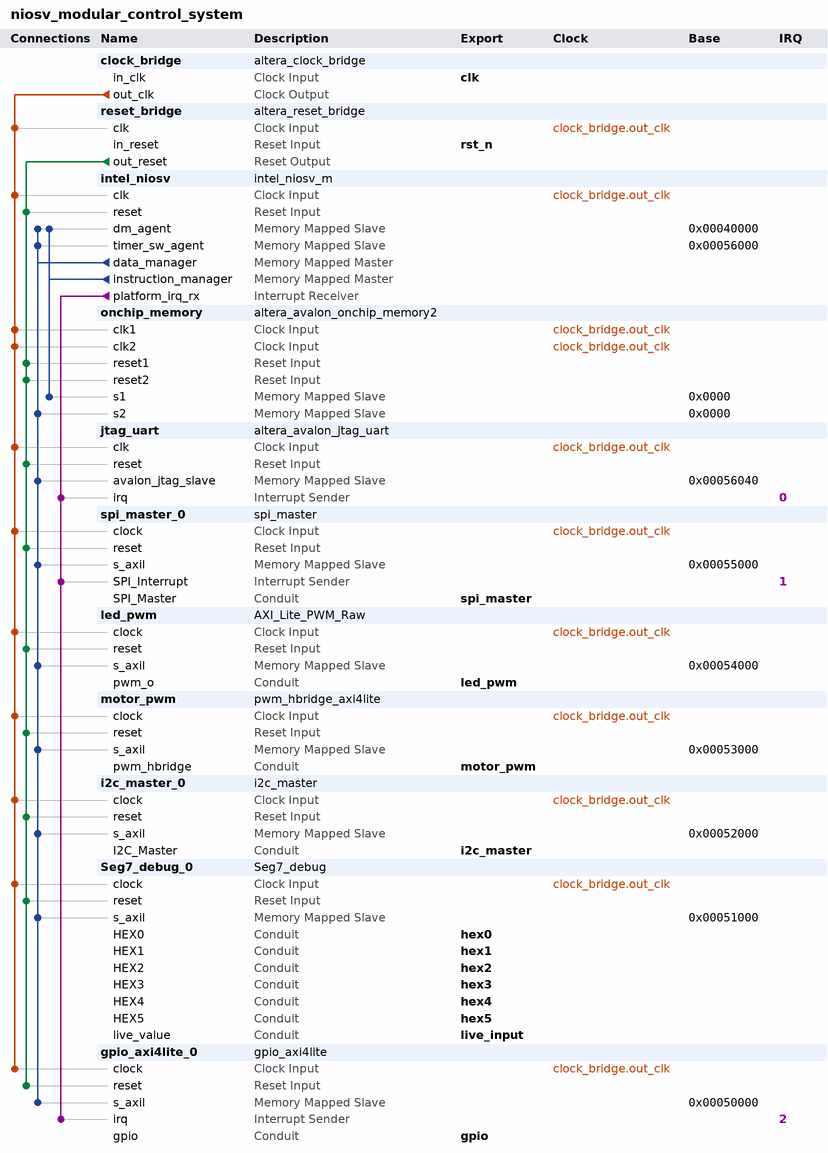
[diagram p0: system contents]
# Platform Designer (Qsys) system niosv_modular_control_system, MAX 10 10M50DAF484C6GES
# Parameters at their usual value, and those the tool derives, are not listed.
package require -exact qsys 25.1
create_system niosv_modular_control_system
set_project_property DEVICE_FAMILY {MAX 10}
set_project_property DEVICE 10M50DAF484C6GES

add_instance clock_bridge altera_clock_bridge 25.1
set_instance_parameter_value clock_bridge DERIVED_CLOCK_RATE 0
set_instance_parameter_value clock_bridge EXPLICIT_CLOCK_RATE 50000000

add_instance reset_bridge altera_reset_bridge 25.1
set_instance_parameter_value reset_bridge ACTIVE_LOW_RESET 1
set_instance_parameter_value reset_bridge SYNCHRONOUS_EDGES deassert

add_instance intel_niosv intel_niosv_m 26.0.0
set_instance_parameter_value intel_niosv enableAvalonInterface false
set_instance_parameter_value intel_niosv enableDebugReset false
set_instance_parameter_value intel_niosv enableECCFull false
set_instance_parameter_value intel_niosv enableECCLite false
set_instance_parameter_value intel_niosv hartId 0
set_instance_parameter_value intel_niosv interruptMode 0
set_instance_parameter_value intel_niosv pipelineArch true
set_instance_parameter_value intel_niosv resetSlave onchip_memory.s1

add_instance onchip_memory altera_avalon_onchip_memory2 25.1
set_instance_parameter_value onchip_memory dataWidth 32
set_instance_parameter_value onchip_memory dualPort true
set_instance_parameter_value onchip_memory initMemContent false
set_instance_parameter_value onchip_memory initializationFileName D:/fpga_projects/fpga-modular-control-system/ram.hex
set_instance_parameter_value onchip_memory memorySize 163840

add_instance jtag_uart altera_avalon_jtag_uart 25.1
set_instance_parameter_value jtag_uart simInteractiveOptions NO_INTERACTIVE_WINDOWS

add_instance spi_master_0 spi_master 1.0
set_instance_parameter_value spi_master_0 ADDR_W 12
set_instance_parameter_value spi_master_0 CLKDIV 20
set_instance_parameter_value spi_master_0 CPHA 1
set_instance_parameter_value spi_master_0 CPOL 1
set_instance_parameter_value spi_master_0 DATA_W 32
set_instance_parameter_value spi_master_0 SPI_DW 8

add_instance led_pwm AXI_Lite_PWM_Raw 3.0
set_instance_parameter_value led_pwm APPLY_ON_PERIOD_END true
set_instance_parameter_value led_pwm AXI_ADDR_W 12
set_instance_parameter_value led_pwm AXI_DATA_W 32
set_instance_parameter_value led_pwm CHANNELS 10
set_instance_parameter_value led_pwm CNT_W 32

add_instance motor_pwm pwm_hbridge_axi4lite 3
set_instance_parameter_value motor_pwm APPLY_ON_PERIOD_END true
set_instance_parameter_value motor_pwm AXI_ADDR_W 12
set_instance_parameter_value motor_pwm AXI_DATA_W 32
set_instance_parameter_value motor_pwm CHANNELS 2
set_instance_parameter_value motor_pwm CNT_W 32

add_instance i2c_master_0 i2c_master 1.0
set_instance_parameter_value i2c_master_0 ADDR_W 12
set_instance_parameter_value i2c_master_0 BYTE_W 8
set_instance_parameter_value i2c_master_0 CMD_W 3
set_instance_parameter_value i2c_master_0 DATA_W 32
set_instance_parameter_value i2c_master_0 DIVISOR_W 16
set_instance_parameter_value i2c_master_0 MIN_DIVISOR 1

add_instance Seg7_debug_0 Seg7_debug 1.0
set_instance_parameter_value Seg7_debug_0 ADDR_W 12
set_instance_parameter_value Seg7_debug_0 DATA_W 32
set_instance_parameter_value Seg7_debug_0 NUM_DIGITS 6

add_instance gpio_axi4lite_0 gpio_axi4lite 1.0
set_instance_parameter_value gpio_axi4lite_0 ADDR_W 12
set_instance_parameter_value gpio_axi4lite_0 DATA_W 32
set_instance_parameter_value gpio_axi4lite_0 GPIO_W 32

# connections
add_connection clock_bridge.out_clk gpio_axi4lite_0.clock clock
add_connection clock_bridge.out_clk i2c_master_0.clock clock
add_connection clock_bridge.out_clk intel_niosv.clk clock
add_connection clock_bridge.out_clk jtag_uart.clk clock
add_connection clock_bridge.out_clk led_pwm.clock clock
add_connection clock_bridge.out_clk motor_pwm.clock clock
add_connection clock_bridge.out_clk onchip_memory.clk1 clock
add_connection clock_bridge.out_clk onchip_memory.clk2 clock
add_connection clock_bridge.out_clk reset_bridge.clk clock
add_connection clock_bridge.out_clk Seg7_debug_0.clock clock
add_connection clock_bridge.out_clk spi_master_0.clock clock
add_connection reset_bridge.out_reset gpio_axi4lite_0.reset reset
add_connection reset_bridge.out_reset i2c_master_0.reset reset
add_connection reset_bridge.out_reset intel_niosv.reset reset
add_connection reset_bridge.out_reset jtag_uart.reset reset
add_connection reset_bridge.out_reset led_pwm.reset reset
add_connection reset_bridge.out_reset motor_pwm.reset reset
add_connection reset_bridge.out_reset onchip_memory.reset1 reset
add_connection reset_bridge.out_reset onchip_memory.reset2 reset
add_connection reset_bridge.out_reset Seg7_debug_0.reset reset
add_connection reset_bridge.out_reset spi_master_0.reset reset
add_connection intel_niosv.data_manager gpio_axi4lite_0.s_axil avalon
set_connection_parameter_value intel_niosv.data_manager/gpio_axi4lite_0.s_axil baseAddress 0x00050000
add_connection intel_niosv.data_manager i2c_master_0.s_axil avalon
set_connection_parameter_value intel_niosv.data_manager/i2c_master_0.s_axil baseAddress 0x00052000
add_connection intel_niosv.data_manager intel_niosv.dm_agent avalon
set_connection_parameter_value intel_niosv.data_manager/intel_niosv.dm_agent baseAddress 0x00040000
add_connection intel_niosv.data_manager intel_niosv.timer_sw_agent avalon
set_connection_parameter_value intel_niosv.data_manager/intel_niosv.timer_sw_agent baseAddress 0x00056000
add_connection intel_niosv.data_manager jtag_uart.avalon_jtag_slave avalon
set_connection_parameter_value intel_niosv.data_manager/jtag_uart.avalon_jtag_slave baseAddress 0x00056040
add_connection intel_niosv.data_manager led_pwm.s_axil avalon
set_connection_parameter_value intel_niosv.data_manager/led_pwm.s_axil baseAddress 0x00054000
add_connection intel_niosv.data_manager motor_pwm.s_axil avalon
set_connection_parameter_value intel_niosv.data_manager/motor_pwm.s_axil baseAddress 0x00053000
add_connection intel_niosv.data_manager onchip_memory.s2 avalon
set_connection_parameter_value intel_niosv.data_manager/onchip_memory.s2 baseAddress 0x0000
add_connection intel_niosv.data_manager Seg7_debug_0.s_axil avalon
set_connection_parameter_value intel_niosv.data_manager/Seg7_debug_0.s_axil baseAddress 0x00051000
add_connection intel_niosv.data_manager spi_master_0.s_axil avalon
set_connection_parameter_value intel_niosv.data_manager/spi_master_0.s_axil baseAddress 0x00055000
add_connection intel_niosv.instruction_manager intel_niosv.dm_agent avalon
set_connection_parameter_value intel_niosv.instruction_manager/intel_niosv.dm_agent baseAddress 0x00040000
add_connection intel_niosv.instruction_manager onchip_memory.s1 avalon
set_connection_parameter_value intel_niosv.instruction_manager/onchip_memory.s1 baseAddress 0x0000
add_connection intel_niosv.platform_irq_rx gpio_axi4lite_0.irq interrupt
set_connection_parameter_value intel_niosv.platform_irq_rx/gpio_axi4lite_0.irq irqNumber 2
add_connection intel_niosv.platform_irq_rx jtag_uart.irq interrupt
set_connection_parameter_value intel_niosv.platform_irq_rx/jtag_uart.irq irqNumber 0
add_connection intel_niosv.platform_irq_rx spi_master_0.SPI_Interrupt interrupt
set_connection_parameter_value intel_niosv.platform_irq_rx/spi_master_0.SPI_Interrupt irqNumber 1

# exported interfaces
add_interface clk clock sink
set_interface_property clk EXPORT_OF clock_bridge.in_clk
add_interface gpio conduit end
set_interface_property gpio EXPORT_OF gpio_axi4lite_0.gpio
add_interface hex0 conduit end
set_interface_property hex0 EXPORT_OF Seg7_debug_0.HEX0
add_interface hex1 conduit end
set_interface_property hex1 EXPORT_OF Seg7_debug_0.HEX1
add_interface hex2 conduit end
set_interface_property hex2 EXPORT_OF Seg7_debug_0.HEX2
add_interface hex3 conduit end
set_interface_property hex3 EXPORT_OF Seg7_debug_0.HEX3
add_interface hex4 conduit end
set_interface_property hex4 EXPORT_OF Seg7_debug_0.HEX4
add_interface hex5 conduit end
set_interface_property hex5 EXPORT_OF Seg7_debug_0.HEX5
add_interface i2c_master conduit end
set_interface_property i2c_master EXPORT_OF i2c_master_0.I2C_Master
add_interface led_pwm conduit end
set_interface_property led_pwm EXPORT_OF led_pwm.pwm_o
add_interface live_input conduit end
set_interface_property live_input EXPORT_OF Seg7_debug_0.live_value
add_interface motor_pwm conduit end
set_interface_property motor_pwm EXPORT_OF motor_pwm.pwm_hbridge
add_interface rst_n reset sink
set_interface_property rst_n EXPORT_OF reset_bridge.in_reset
add_interface spi_master conduit end
set_interface_property spi_master EXPORT_OF spi_master_0.SPI_Master

set_interconnect_requirement {$system} qsys_mm.clockCrossingAdapter HANDSHAKE
set_interconnect_requirement {$system} qsys_mm.enableEccProtection FALSE
set_interconnect_requirement {$system} qsys_mm.insertDefaultSlave FALSE
set_interconnect_requirement {$system} qsys_mm.maxAdditionalLatency 1

save_system niosv_modular_control_system.qsys
